# EAGLE design racer2 (EAGLE 7.5.0)
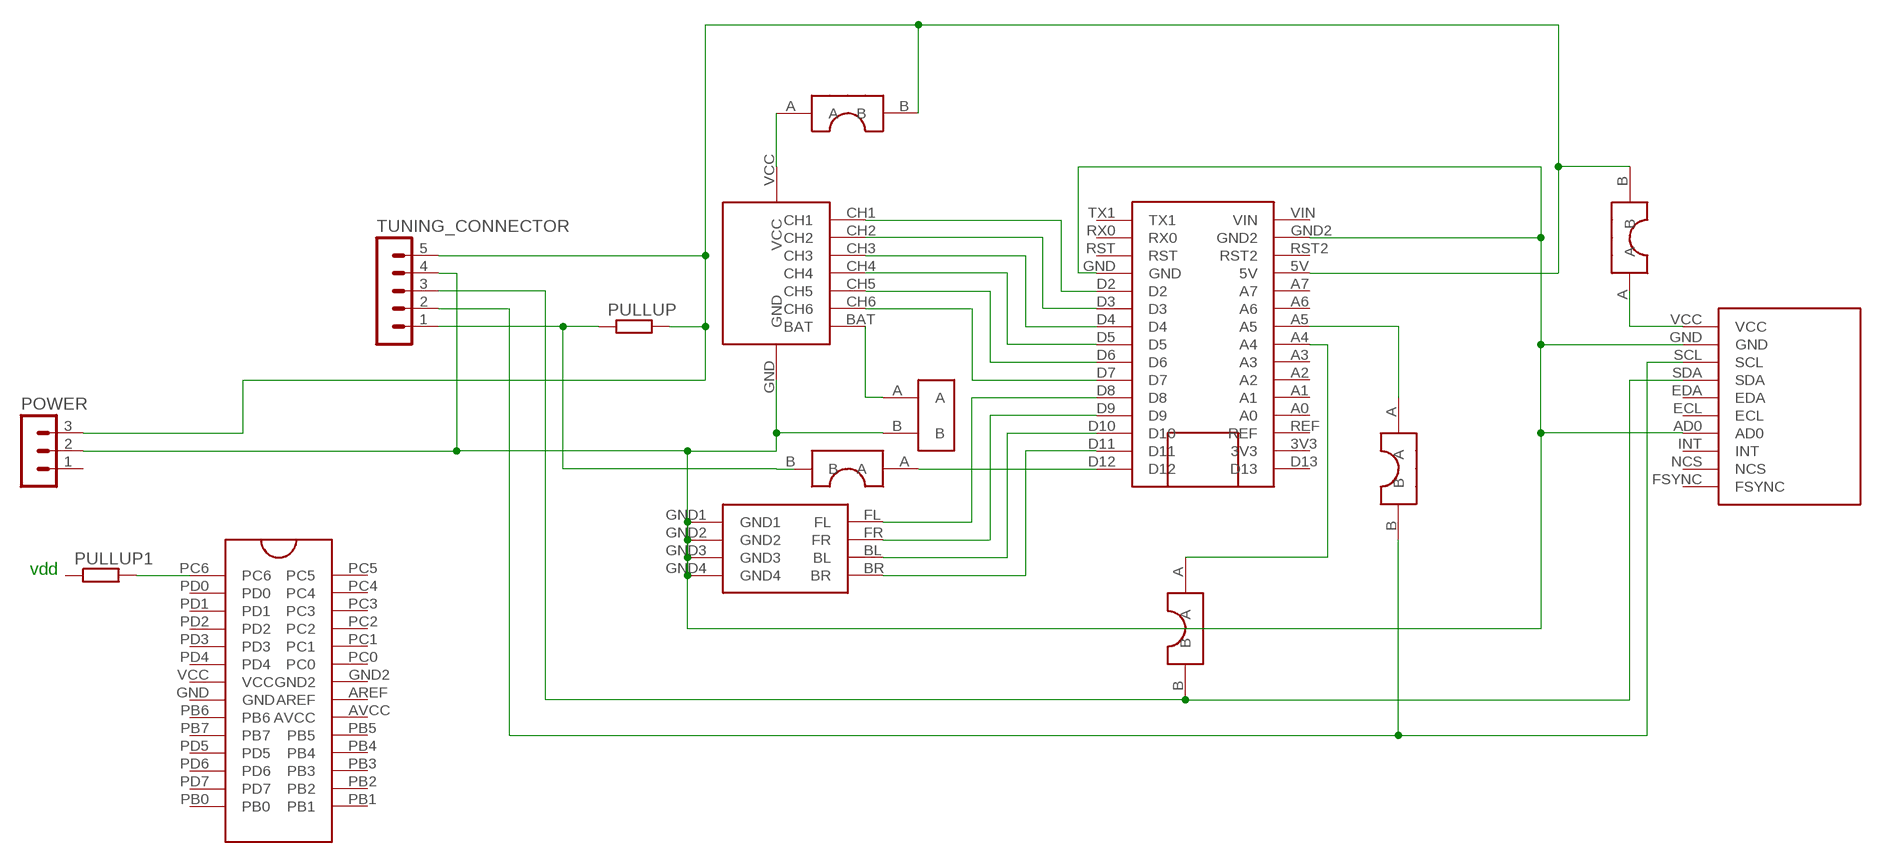
[diagram p0: schematic, sheet 1]

## Parts
POWER  MA03-1  [MA03-1]
PULLUP  R0204/7  [0204/7]
PULLUP1  R0204/7  [0204/7]
TUNING_CONNECTOR  MA05-1  [MA05-1]
U$1  NANO  [NANO]
U$2  BUTTON_PULLUP  [BUTTON_PULLUP]
U$3  FS_RADIO  [FS_RADIO]
U$4  MPU9250  [MPU9250]
U$5  MOTOR_HEADER  [MOTOR_HEADER]
U$6  BRIDGE  [BRIDGE]
U$7  BRIDGE  [BRIDGE]
U$8  BRIDGE  [BRIDGE]
U$9  BRIDGE  [BRIDGE]
U$10  BRIDGE  [BRIDGE]
U$11  ATMEGA328P  [ATMEGA328P]

## Nets
5V: POWER.3 PULLUP.2 TUNING_CONNECTOR.5 U$1.5V U$9.B U$10.B
GND: POWER.2 TUNING_CONNECTOR.4 U$1.GND U$1.GND2 U$2.B U$3.GND U$4.AD0 U$4.GND U$5.GND1 U$5.GND2 U$5.GND3 U$5.GND4
N$1: U$1.D12 U$8.A
N$2: U$1.A5 U$7.A
N$3: TUNING_CONNECTOR.3 U$4.SDA U$6.B
N$4: U$1.D3 U$3.CH2
N$5: U$1.D2 U$3.CH1
N$6: U$1.D4 U$3.CH3
N$7: U$1.D5 U$3.CH4
N$8: U$1.D6 U$3.CH5
N$9: U$1.D7 U$3.CH6
N$10: U$1.D8 U$5.FL
N$11: U$1.D9 U$5.FR
N$12: U$1.D10 U$5.BL
N$13: U$1.D11 U$5.BR
N$14: U$2.A U$3.BAT
N$15: U$3.VCC U$9.A
N$16: PULLUP.1 TUNING_CONNECTOR.1 U$8.B
N$17: U$1.A4 U$6.A
N$18: TUNING_CONNECTOR.2 U$4.SCL U$7.B
N$19: U$4.VCC U$10.A
N$20: PULLUP1.2 U$11.PC6
Unconnected: POWER.1 PULLUP1.1 U$1.3V3 U$1.A0 U$1.A1 U$1.A2 U$1.A3 U$1.A6 U$1.A7 U$1.D13 U$1.REF U$1.RST U$1.RST2 U$1.RX0 U$1.TX1 U$1.VIN U$4.ECL U$4.EDA U$4.FSYNC U$4.INT U$4.NCS U$11.AREF U$11.AVCC U$11.GND U$11.GND2 U$11.PB0 U$11.PB1 U$11.PB2 U$11.PB3 U$11.PB4 U$11.PB5 U$11.PB6 U$11.PB7 U$11.PC0 U$11.PC1 U$11.PC2 U$11.PC3 U$11.PC4 U$11.PC5 U$11.PD0 U$11.PD1 U$11.PD2 U$11.PD3 U$11.PD4 U$11.PD5 U$11.PD6 U$11.PD7 U$11.VCC

## Notes on the sheet
- vdd

## Library data of the parts
POWER = con-lstb:MA03-1: PIN HEADER; OC_FARNELL: unknown; OC_NEWARK: unknown
PULLUP PULLUP1 = eagle-ltspice:R: RESISTOR, European symbol; SPICEMODEL: NONE; SPICEPREFIX: R
TUNING_CONNECTOR = con-lstb:MA05-1: PIN HEADER; OC_FARNELL: unknown; OC_NEWARK: unknown
U$1 = quadcopter_comp:NANO
U$2 = quadcopter_comp:BUTTON_PULLUP
U$3 = quadcopter_comp:FS_RADIO
U$4 = quadcopter_comp:MPU9250
U$5 = quadcopter_comp:MOTOR_HEADER
U$6-U$10 = quadcopter_comp:BRIDGE
U$11 = quadcopter_comp:ATMEGA328P

## Board
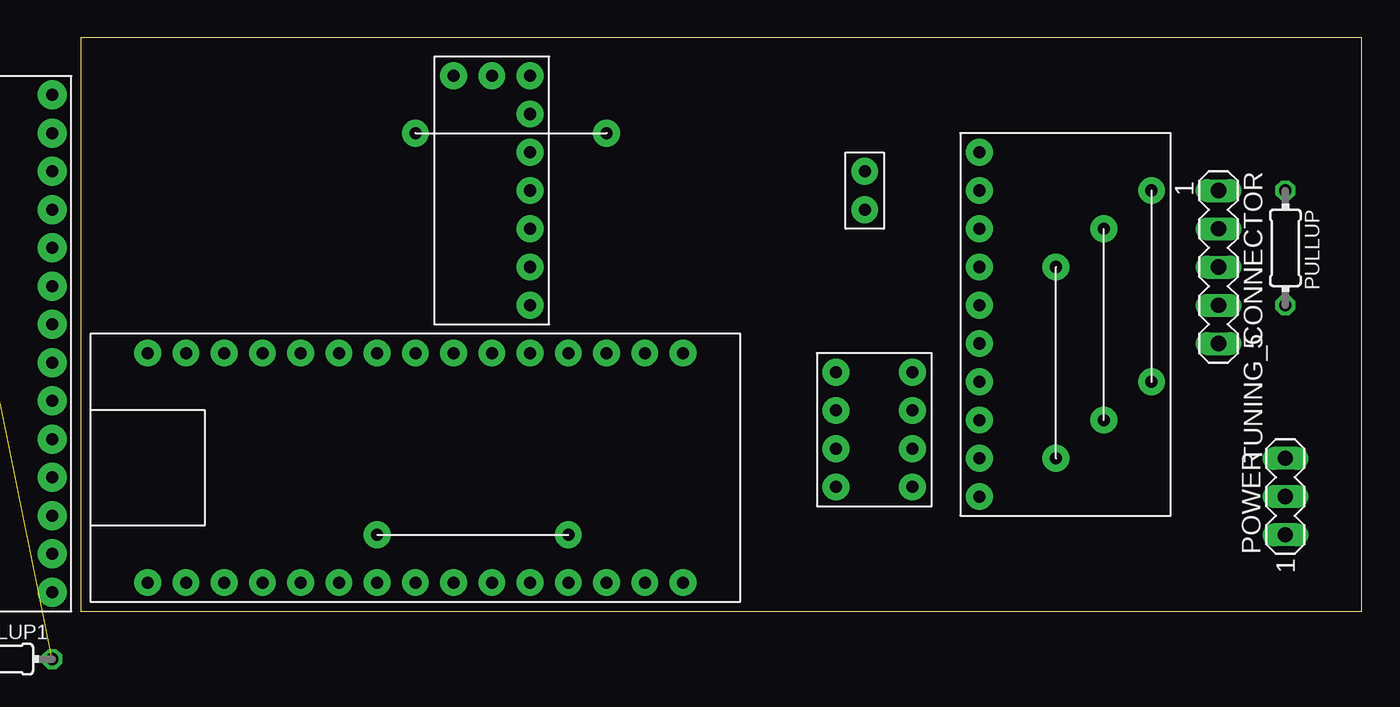
[diagram p1: board, top side]
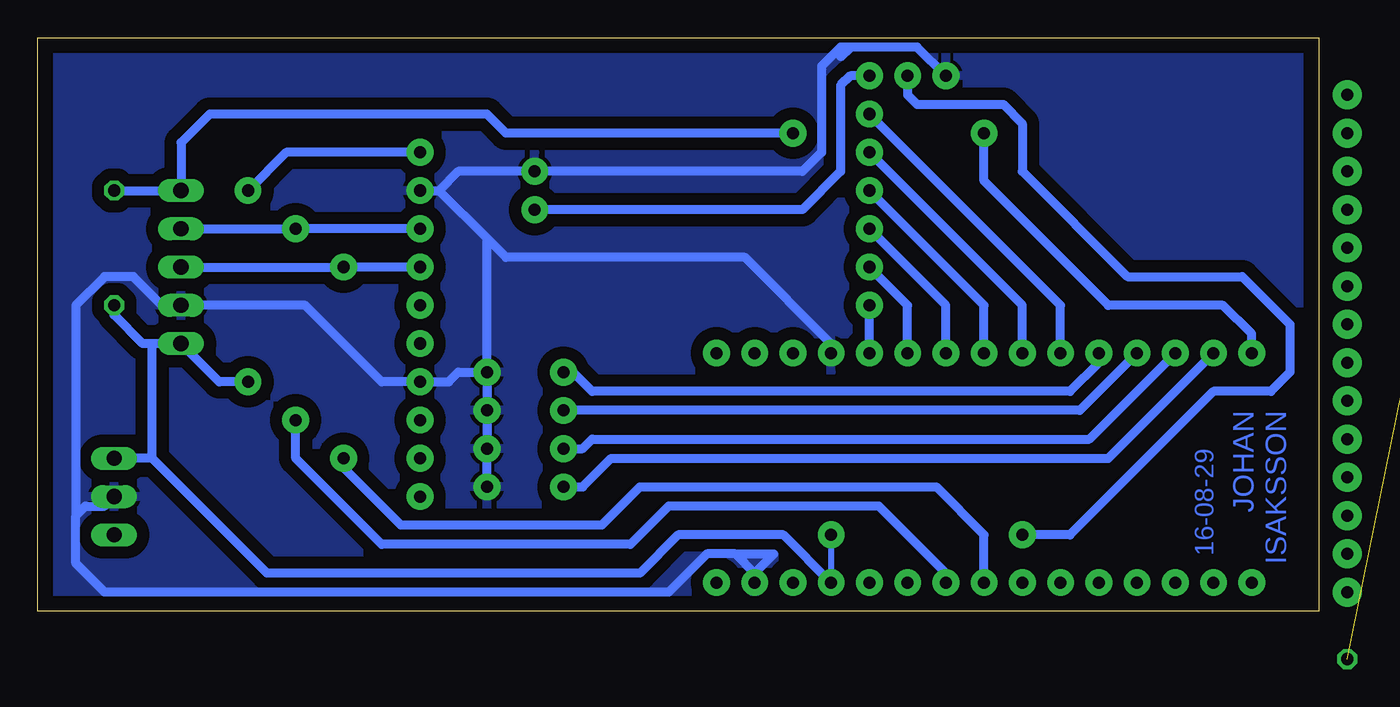
[diagram p2: board, bottom side, seen from below]

Size 85.09 x 38.09 mm. Coordinates in mm from the lower left corner, seen from the top.
Outline: 0,0 85.09,0 85.09,38.09 0,38.09 0,0
Copper layers (1*16): Top 0.035mm / dielectric 1.5mm / Bottom 0.035mm
Design rules "default *": minimum track width 16mil, minimum drill 24mil, track to track 20mil, track to pad 20mil, pad to pad 8mil, via to via 8mil, smd to smd 8mil, copper to edge 40mil, drill to drill 8mil, minimum pad ring 10mil, minimum via ring 8mil, stop-mask expansion 4mil, vias tented up to drill 0mil, thermal gap 10mil

### Footprints (pad centres in the part's own frame; a part is rotated, then mirrored left to right if it is on the bottom)
MA03-1 = drill 1.016 long: 1 -2.54,0; 2 0,0; 3 2.54,0
0204/7 = drill 0.813 octagon: 1 -3.81,0; 2 3.81,0
MA05-1 = drill 1.016 long: 1 -5.08,0; 2 -2.54,0; 3 0,0; 4 2.54,0; 5 5.08,0
NANO = drill 0.8 pad 1.778: 3V3 7.62,-15.24; 5V 7.62,10.16; A0 7.62,-10.16; A1 7.62,-7.62; A2 7.62,-5.08; A3 7.62,-2.54; A4 7.62,0; A5 7.62,2.54; A6 7.62,5.08; A7 7.62,7.62; D2 -7.62,7.62; D3 -7.62,5.08; D4 -7.62,2.54; D5 -7.62,0; D6 -7.62,-2.54; D7 -7.62,-5.08; D8 -7.62,-7.62; D9 -7.62,-10.16; D10 -7.62,-12.7; D11 -7.62,-15.24; D12 -7.62,-17.78; D13 7.62,-17.78; GND -7.62,10.16; GND2 7.62,15.24; REF 7.62,-12.7; RST -7.62,12.7; RST2 7.62,12.7; RX0 -7.62,15.24; TX1 -7.62,17.78; VIN 7.62,17.78
BUTTON_PULLUP = drill 0.8 pad 1.778: A 0,1.27; B 0,-1.27
FS_RADIO = drill 0.8 pad 1.778: BAT -2.54,-7.62; CH1 -2.54,7.62; CH2 -2.54,5.08; CH3 -2.54,2.54; CH4 -2.54,0; CH5 -2.54,-2.54; CH6 -2.54,-5.08; GND 2.54,-7.62; VCC 0,-7.62
MPU9250 = drill 0.8 pad 1.778: AD0 -6.35,-3.81; ECL -6.35,-1.27; EDA -6.35,1.27; FSYNC -6.35,-11.43; GND -6.35,8.89; INT -6.35,-6.35; NCS -6.35,-8.89; SCL -6.35,6.35; SDA -6.35,3.81; VCC -6.35,11.43
MOTOR_HEADER = drill 0.8 pad 1.778: BL -2.54,-1.27; BR -2.54,-3.81; FL -2.54,3.81; FR -2.54,1.27; GND1 2.54,3.81; GND2 2.54,1.27; GND3 2.54,-1.27; GND4 2.54,-3.81
BRIDGE = drill 0.8 pad 1.778: A 0,6.35; B 0,-6.35
ATMEGA328P = drill 0.8 pad 1.93: AREF 3.81,-1.27; AVCC 3.81,-3.81; GND -3.81,-1.27; GND2 3.81,1.27; PB0 -3.81,-16.51; PB1 3.81,-16.51; PB2 3.81,-13.97; PB3 3.81,-11.43; PB4 3.81,-8.89; PB5 3.81,-6.35; PB6 -3.81,-3.81; PB7 -3.81,-6.35; PC0 3.81,3.81; PC1 3.81,6.35; PC2 3.81,8.89; PC3 3.81,11.43; PC4 3.81,13.97; PC5 3.81,16.51; PC6 -3.81,16.51; PD0 -3.81,13.97; PD1 -3.81,11.43; PD2 -3.81,8.89; PD3 -3.81,6.35; PD4 -3.81,3.81; PD5 -3.81,-8.89; PD6 -3.81,-11.43; PD7 -3.81,-13.97; VCC -3.81,1.27

### Placement (x,y rotation side)
POWER  80.01,7.62 90 top
PULLUP  80.01,24.13 270 top
PULLUP1  -5.71,-3.17 0 top  (outside the outline)
TUNING_CONNECTOR  75.56,22.86 270 top
U$1  22.23,9.53 270 top
U$2  52.07,27.94 180 top
U$3  27.3,27.94 180 top
U$4  66.04,19.05 0 top
U$5  52.7,12.06 0 top
U$6  64.77,16.51 180 top
U$7  67.94,19.05 180 top
U$8  28.57,31.75 90 top
U$9  26.04,5.08 90 top
U$10  71.12,21.59 0 top
U$11  -5.71,17.78 0 top

### Tracks (layer width: path | path; a pad name or v marks a point on that pad's centre or on a via)
5V
  Bottom 0.406: U$9.B U$1.5V
  Bottom 0.61: 77.47,17.78 TUNING_CONNECTOR.5 73.03,15.24 U$10.B | 77.47,17.78 78.11,17.78 80.01,19.68 PULLUP.2 | U$1.5V 35.56,5.08 42.55,5.08 45.09,2.54 69.85,2.54 77.47,10.16 | 77.47,10.16 POWER.3 | 77.47,10.16 77.47,17.78
GND
  Bottom 0.61: U$5.GND4 U$5.GND3 U$5.GND2 U$5.GND1 | U$4.GND 58.42,27.94 | 58.42,27.94 55.24,24.77 | 55.24,24.77 53.98,23.5 38.1,23.5 32.38,17.78 U$1.GND | U$1.GND2 37.47,2.54 | 37.47,2.54 38.73,3.81 | 38.73,3.81 40.64,3.81 43.18,1.27 80.64,1.27 82.55,3.17 82.55,6.35 | 82.55,6.35 81.92,6.99 80.64,6.99 POWER.2 | U$3.GND 26.67,37.47 31.11,37.47 | U$5.GND1 57.15,15.88 57.78,15.24 U$4.AD0 62.23,15.24 67.31,20.32 TUNING_CONNECTOR.4 76.83,20.32 78.74,22.23 80.64,22.23 82.55,20.32 82.55,6.35 | U$5.GND1 55.24,24.77 | 31.11,37.47 31.75,37.47 33.02,36.2 33.02,30.48 34.29,29.21 U$2.B 57.15,29.21 58.42,27.94 | 38.73,3.81 36.2,3.81 37.47,2.54 | 31.75,36.83 31.11,37.47
  pour Bottom (isolate 0.813): 0,38.1 85.09,38.1 85.09,0 0,0
N$1
  Bottom 0.61: U$1.D12 4.45,18.41 6.35,20.32 13.97,20.32 22.23,28.57 U$8.A
N$2
  Bottom 0.61: U$7.A 67.94,10.16 62.23,4.45 45.72,4.45 43.18,6.99 29.21,6.99 24.77,2.54 U$1.A5
N$3
  Bottom 0.61: U$4.SDA U$6.B TUNING_CONNECTOR.3
N$4
  Bottom 0.61: U$1.D3 27.3,20.32 U$3.CH2
N$5
  Bottom 0.61: U$1.D2 U$3.CH1
N$6
  Bottom 0.61: U$1.D4 24.77,20.32 U$3.CH3
N$7
  Bottom 0.61: U$1.D5 22.23,20.32 U$3.CH4
N$8
  Bottom 0.61: U$1.D6 19.68,20.32 U$3.CH5
N$9
  Bottom 0.61: U$1.D7 17.14,20.32 U$3.CH6
N$10
  Bottom 0.61: U$1.D8 14.61,16.51 16.51,14.61 48.26,14.61 49.53,15.88 U$5.FL
N$11
  Bottom 0.61: U$1.D9 15.88,13.34 U$5.FR
N$12
  Bottom 0.61: U$1.D10 15.24,11.43 48.26,11.43 48.9,10.79 U$5.BL
N$13
  Bottom 0.61: U$1.D11 13.97,10.16 46.99,10.16 48.9,8.26 U$5.BR
N$14
  Bottom 0.61: U$3.BAT 31.11,35.56 31.75,34.92 31.75,29.21 34.29,26.67 U$2.A
N$15
  Bottom 0.61: U$9.A 16.51,5.08 6.99,14.61 3.17,14.61 1.91,15.88 1.91,19.05 5.08,22.23 12.7,22.23 19.68,29.21 19.68,32.38 20.95,33.66 26.67,33.66 27.3,34.29 U$3.VCC
N$16
  Bottom 0.61: PULLUP.1 TUNING_CONNECTOR.1 75.56,31.11 73.66,33.02 55.24,33.02 53.98,31.75 U$8.B
N$17
  Bottom 0.61: U$1.A4 22.23,5.08 25.4,8.26 45.09,8.26 47.62,5.71 60.96,5.71 64.77,9.53 U$6.A
N$18
  Bottom 0.61: TUNING_CONNECTOR.2 U$7.B U$4.SCL
N$19
  Bottom 0.61: U$4.VCC 68.58,30.48 U$10.A
N$20  (1 unrouted)

### Text on the board
Bottom: JOHAN / ISAKSSON | 16-08-29